# EAGLE design controller7b (EAGLE 8.1.1)

## Sheet 1 of 2
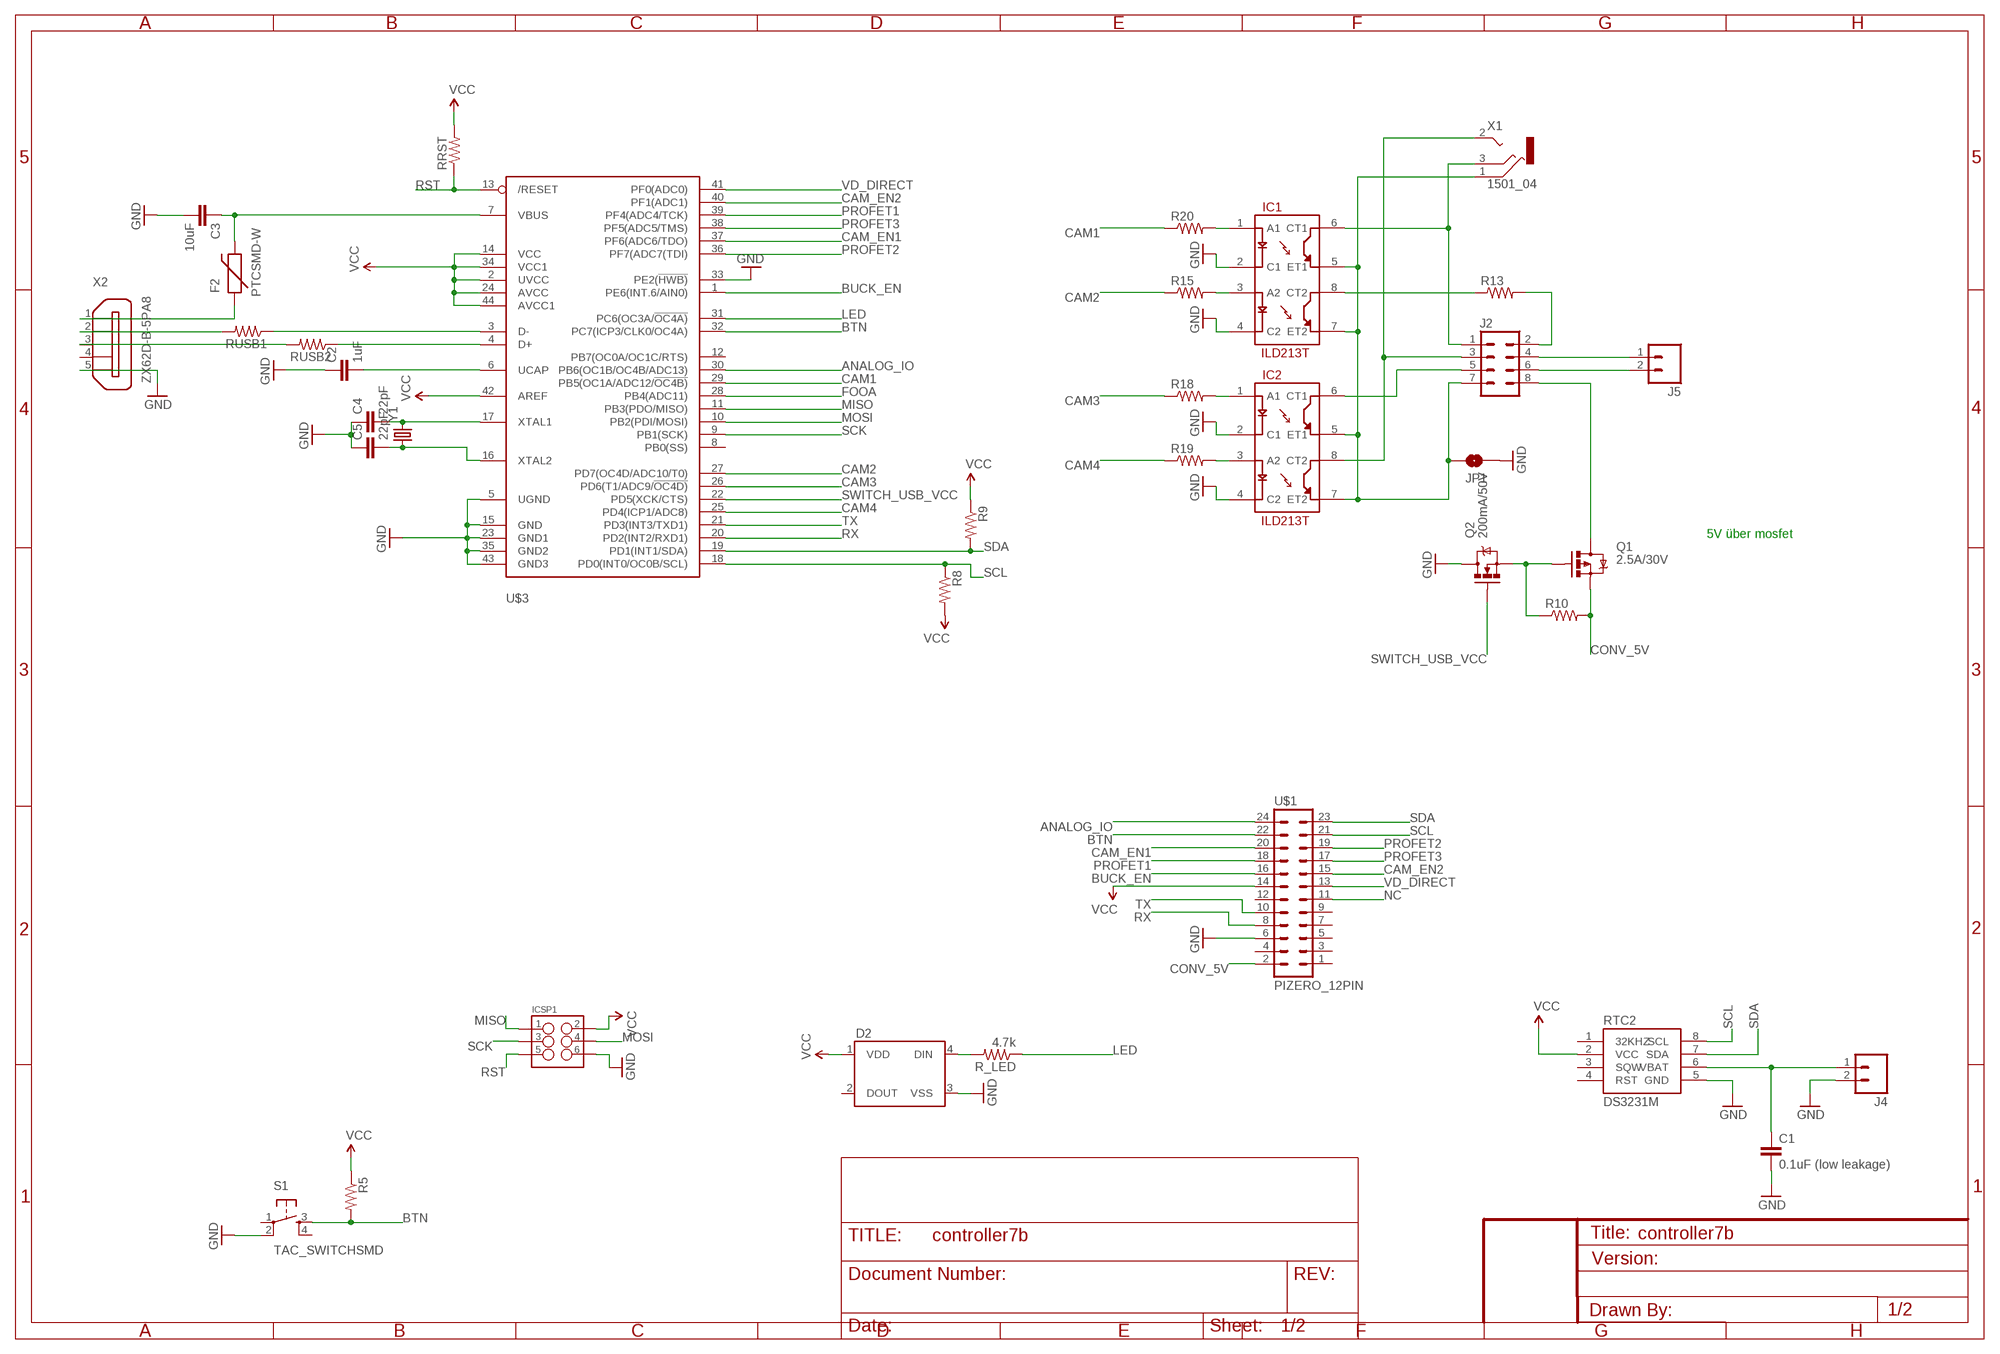
[diagram p0: schematic, sheet 1]

### Parts
C1  0.1uF (low leakage)  CAP1206  [1206]
C2  1uF  CAP1206  [1206]
C3  10uF  CAP1206  [1206]
C4  22pF  CAP0805  [0805]
C5  22pF  CAP0805  [0805]
D2  WS2812B  [WS2812B]
F2  PTCSMD-W  [PTC-1206-WIDE]
IC1  ILD213T  [SO08]
IC2  ILD213T  [SO08]
ICSP1  M03X2FEMALE  [2X3]
J2  M04X2  [2X4]
J4  M02PTH  [1X02]
J5  M02PTH  [1X02]
JP1  JUMPER-PAD-2-NOYES_SILK  [PAD-JUMPER-2-NO_YES_SILK]
Q1  2.5A/30V  MOSFET-PCHANNELDMG2307L  [SOT23-3]
Q2  200mA/50V  MOSFET-NCHANNELBSS138  [SOT23-3]
R5  RESISTOR1206  [1206]
R8  RESISTOR1206  [1206]
R9  RESISTOR1206  [1206]
R10  RESISTOR0805-RES  [0805]
R13  RESISTOR1206  [1206]
R15  RESISTOR0805-RES  [0805]
R18  RESISTOR0805-RES  [0805]
R19  RESISTOR0805-RES  [0805]
R20  RESISTOR0805-RES  [0805]
R_LED  4.7k  RESISTOR1206  [1206]
RRST  RESISTOR1206  [1206]
RTC2  DS3231M  [SOIC8]
RUSB1  RESISTOR1206  [1206]
RUSB2  RESISTOR1206  [1206]
S1  TAC_SWITCHSMD  TAC_SWITCHPTH  [TACTILE-PTH]
U$1  PIZERO_12PIN  [PIZERO_12PIN]
U$3  ATMEGA32U4-AU  [TQFP44]
X1  1501_04  [1501_05]
X2  ZX62D-B-5PA8  [ZX62D-B-5PA8]
Y1  CRYSTALCRYSTAL-SMD-5X3-16MHZ  [CRYSTAL-SMD-5X3]

### Nets
ANALOG_IO: U$1.24 U$3.30(PB6(OC1B/OC4B/ADC13))
BTN: R5.2 S1.3 U$1.22 U$3.32(PC7(ICP3/CLK0/OC4A))
BUCK_EN: U$1.16 U$3.1(PE6(INT.6/AIN0))
CAM1: R20.1 U$3.29(PB5(OC1A/ADC12/!OC4B))
CAM2: R15.1 U$3.27(PD7(OC4D/ADC10/T0))
CAM3: R18.1 U$3.26(PD6(T1/ADC9/!OC4D))
CAM4: R19.1 U$3.25(PD4(ICP1/ADC8))
CAM_EN1: U$1.20 U$3.37(PF6(ADC6/TDO))
CAM_EN2: U$1.15 U$3.40(PF1(ADC1))
CONV_5V [power]: Q1.2(S) R10.2 U$1.2
FOOA: U$3.28(PB4(ADC11))
GND [power]: C1.2 C2.1 C3.2 C4.1 C5.1 D2.3(VSS) IC1.2(C1) IC1.4(C2) IC2.2(C1) IC2.4(C2) ICSP1.6 J4.2 JP1.1 Q2.3(D) RTC2.5(GND) S1.2 U$1.6 U$3.5(UGND) U$3.15(GND) U$3.23(GND1) U$3.33(PE2(!HWB)) U$3.35(GND2) U$3.43(GND3) X2.5
LED: R_LED.1 U$3.31(PC6(OC3A/!OC4A))
MISO: ICSP1.1 U$3.11(PB3(PDO/MISO))
MOSI: ICSP1.4 U$3.10(PB2(PDI/MOSI))
N$1: J2.4 J5.1
N$4: RUSB1.1 U$3.3(D-)
N$5: RUSB2.1 U$3.4(D+)
N$6: J2.6 J5.2
N$7: D2.4(DIN) R_LED.2
N$8: C4.2 U$3.17(XTAL1) Y1.3
N$9: C5.2 U$3.16(XTAL2) Y1.1
N$10: RUSB1.2 X2.2
N$11: RUSB2.2 X2.3
N$12: IC2.1(A1) R18.2
N$13: IC2.3(A2) R19.2
N$15: IC1.3(A2) R15.2
N$16: J2.2 R13.2
N$18: IC1.8(CT2) R13.1
N$19: IC1.1(A1) R20.2
N$20: C2.2 U$3.6(UCAP)
N$22: C3.1 F2.2 U$3.7(VBUS)
N$31: IC1.6(CT1) J2.1 X1.3
N$32: IC2.8(CT2) J2.3 X1.2
N$33: IC2.6(CT1) J2.5
N$34: IC1.5(ET1) IC1.7(ET2) IC2.5(ET1) IC2.7(ET2) J2.7 JP1.2 X1.1
N$35: J2.8 Q1.3(D)
N$36: Q1.1(G) Q2.2(S) R10.1
N$38: F2.1 X2.1
N$39: C1.1 J4.1 RTC2.6(VBAT)
NC: U$1.11
PROFET1: U$1.18 U$3.39(PF4(ADC4/TCK))
PROFET2: U$1.19 U$3.36(PF7(ADC7(TDI))
PROFET3: U$1.17 U$3.38(PF5(ADC5/TMS))
RST: ICSP1.5 RRST.1 U$3.13(/RESET)
RX: U$1.8 U$3.20(PD2(INT2/RXD1))
SCK: ICSP1.3 U$3.9(PB1(SCK))
SCL: R8.1 RTC2.8(SCL) U$1.21 U$3.18(PD0(INT0/OC0B/SCL))
SDA: R9.2 RTC2.7(SDA) U$1.23 U$3.19(PD1(INT1/SDA))
SWITCH_USB_VCC: Q2.1(G) U$3.22(PD5(XCK/CTS))
TX: U$1.10 U$3.21(PD3(INT3/TXD1))
VCC [power]: D2.1(VDD) ICSP1.2 R5.1 R8.2 R9.1 RRST.2 RTC2.2(VCC) U$1.14 U$3.2(UVCC) U$3.14(VCC) U$3.24(AVCC) U$3.34(VCC1) U$3.42(AREF) U$3.44(AVCC1)
VD_DIRECT: U$1.13 U$3.41(PF0(ADC0))
Unconnected: D2.2(DOUT) RTC2.1(32KHZ) RTC2.3(SQW) RTC2.4(RST) S1.1 S1.4 U$1.1 U$1.3 U$1.4 U$1.5 U$1.7 U$1.9 U$1.12 U$3.8(PB0(SS)) U$3.12(PB7(OC0A/OC1C/RTS)) X2.4 X2.S1 X2.S2 X2.S3 X2.S4

### Notes on the sheet
- 5V über mosfet

## Sheet 2 of 2
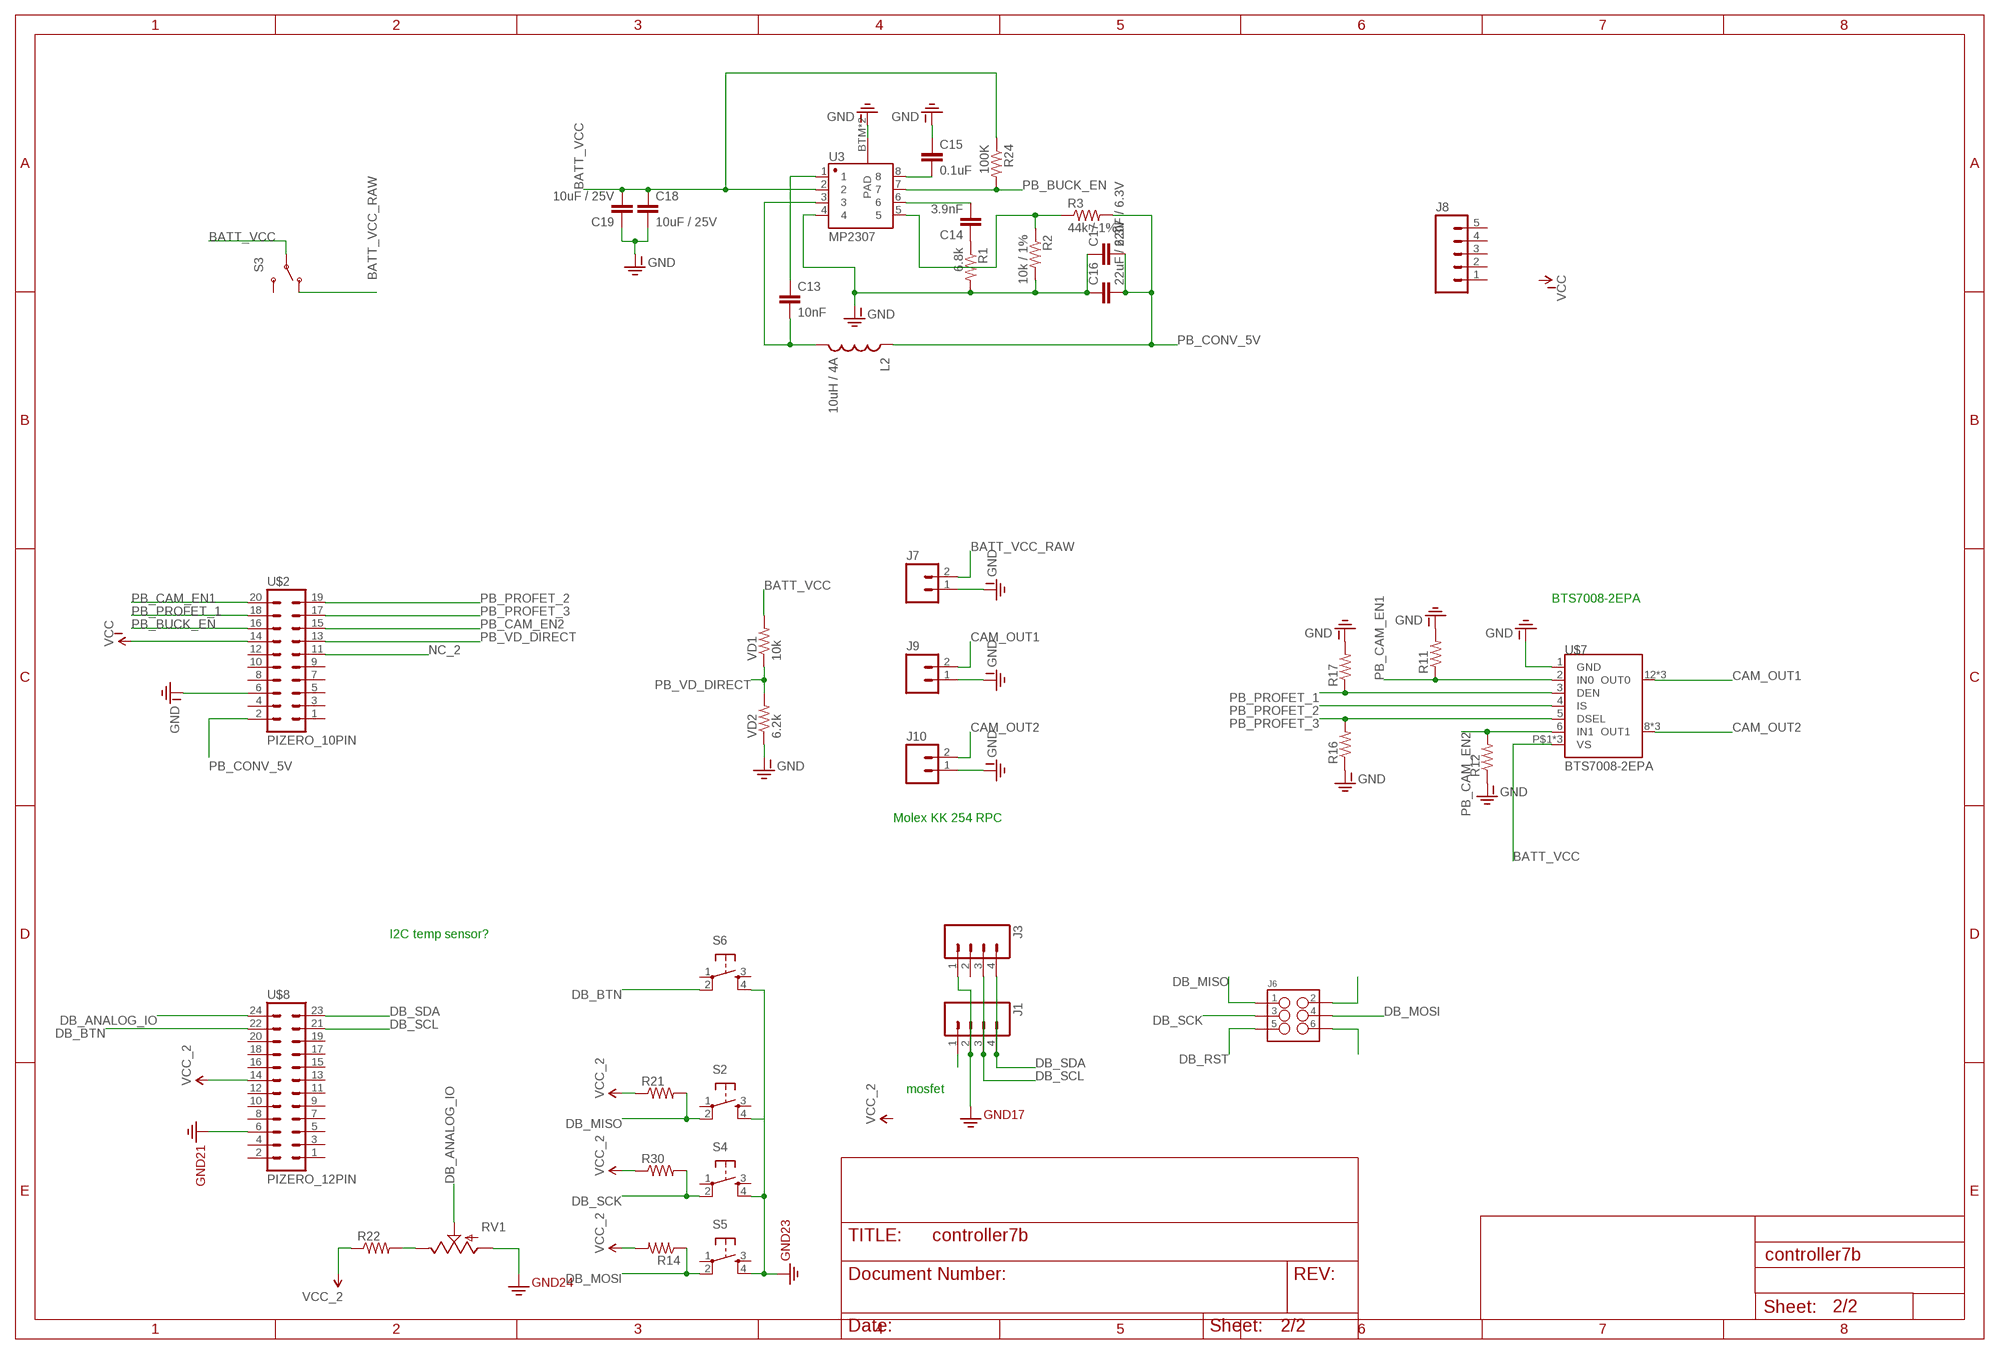
[diagram p1: schematic, sheet 2]

### Parts
C13  10nF  CAP1206  [1206]
C14  3.9nF  CAP0805  [0805]
C15  0.1uF  CAP0805  [0805]
C16  22uF / 6.3V  CAP1210  [1210]
C17  22uF / 6.3V  CAP1210  [1210]
C18  10uF / 25V  CAP1210  [1210]
C19  10uF / 25V  CAP1210  [1210]
J1  M04LOCK  [1X04_LOCK]
J3  M04LOCK  [1X04_LOCK]
J6  M03X2FEMALE  [2X3]
J7  M02LOCK  [1X02_LOCK]
J8  M05LOCK  [1X05_LOCK]
J9  M02LOCK  [1X02_LOCK]
J10  M02LOCK  [1X02_LOCK]
L2  10uH / 4A  INDUCTORSRU1038  [SRU1038]
R1  6.8k  RESISTOR0805-RES  [0805]
R2  10k / 1%  RESISTOR0805-RES  [0805]
R3  44k / 1%  RESISTOR0805-RES  [0805]
R11  RESISTOR1206  [1206]
R12  RESISTOR1206  [1206]
R14  RESISTOR1206  [1206]
R16  RESISTOR1206  [1206]
R17  RESISTOR1206  [1206]
R21  RESISTOR1206  [1206]
R22  RESISTOR1206  [1206]
R24  100K  RESISTOR0805-RES  [0805]
R30  RESISTOR1206  [1206]
RV1  POT  [ALPS_POT]
S2  TAC_SWITCHPTH  [TACTILE-PTH]
S3  SWITCH-SPDTPTH_LOCK  [SWITCH-SPDT_LOCK.007S]
S4  TAC_SWITCHPTH  [TACTILE-PTH]
S5  TAC_SWITCHPTH  [TACTILE-PTH]
S6  TAC_SWITCHPTH  [TACTILE-PTH]
U3  MP2307  GENERIC-SOIC8MSGEQ7N-FILTER  [SO08]
U$2  PIZERO_10PIN  [PIZERO_10PIN]
U$7  BTS7008-2EPA  [SOIC-14-PAD]
U$8  PIZERO_12PIN  [PIZERO_12PIN]
VD1  10k  RESISTOR1206  [1206]
VD2  6.2k  RESISTOR1206  [1206]

### Nets
3.3V [power]: J1.2 J3.1 RV1.P$3(A) S2.4 S4.4 S5.4 S6.4 U$8.6 ; supply symbol labelled GND2
BATT_VCC [camera_power]: C18.1 C19.2 R24.1 S3.2(P) U3.2 U$7.P$1(VS) U$7.P$2(VS) U$7.VS VD1.2
BATT_VCC_RAW [camera_power]: J7.2 S3.1(O)
CAM_OUT1 [camera_power]: J9.2 U$7.12(OUT0) U$7.13(OUT0) U$7.14(OUT0)
CAM_OUT2 [camera_power]: J10.2 U$7.8(OUT1) U$7.9(OUT1) U$7.10(OUT1)
DB_ANALOG_IO: RV1.P$2(S) U$8.24
DB_BTN: S6.2 U$8.22
DB_MISO: J6.1 R21.2 S2.2
DB_MOSI: J6.4 R14.1 S5.2
DB_RST: J6.5
DB_SCK: J6.3 R30.2 S4.2
DB_SCL: J1.3 J3.3 U$8.21
DB_SDA: J1.4 J3.4 U$8.23
GND-ISO [power]: C15.1 C16.1 C17.1 C18.2 C19.1 J7.1 J9.1 J10.1 R1.2 R2.2 R11.2 R12.1 R16.1 R17.2 U3.4 U3.BTM(PAD) U3.P$1(PAD) U$2.6 U$7.1(GND) VD2.1 ; supply symbol labelled GND
N$25: C15.2 U3.8
N$26 [power]: C13.2 L2.2 U3.3
N$27: C13.1 U3.1
N$28: C14.1 R1.1
N$29: C14.2 U3.6
N$30: R2.1 R3.1 U3.5
N$37 [camera_power]: J1.1
N$43: R22.2 RV1.P$1(E)
N$45: J6.2
N$46: J6.6
NC_2: U$2.11
PB_BUCK_EN: R24.2 U3.7 U$2.16
PB_CAM_EN1: R11.1 U$2.20 U$7.2(IN0)
PB_CAM_EN2: R12.2 U$2.15 U$7.6(IN1)
PB_CONV_5V [power]: C16.2 C17.2 L2.1 R3.2 U$2.2
PB_PROFET_1: R17.1 U$2.18 U$7.3(DEN)
PB_PROFET_2: U$2.19 U$7.4(IS)
PB_PROFET_3: R16.2 U$2.17 U$7.5(DSEL)
PB_VD_DIRECT: U$2.13 VD1.1 VD2.2
VCC-ISO [power]: U$2.14 ; supply symbol labelled VCC
VCC_2 [power]: R14.2 R21.1 R22.1 R30.1 U$8.14
Unconnected: J3.2 J8.1 J8.2 J8.3 J8.4 J8.5 S2.1 S2.3 S3.3(S) S4.1 S4.3 S5.1 S5.3 S6.1 S6.3 U$2.1 U$2.3 U$2.4 U$2.5 U$2.7 U$2.8 U$2.9 U$2.10 U$2.12 U$8.1 U$8.2 U$8.3 U$8.4 U$8.5 U$8.7 U$8.8 U$8.9 U$8.10 U$8.11 U$8.12 U$8.13 U$8.15 U$8.16 U$8.17 U$8.18 U$8.19 U$8.20

### Notes on the sheet
- BTS7008-2EPA
- Molex KK 254 RPC
- I2C temp sensor?
- mosfet

## Library data of the parts
C1 C2 C13-C19 = SparkFun-Capacitors:CAP: Capacitor Standard 0603 ceramic capacitor, and 0.1" leaded capacitor.
C3-C5 = SparkFun-Passives:CAP: Capacitor Standard 0603 ceramic capacitor, and 0.1" leaded capacitor.
D2 = SparkFun-LED:WS2812B: WS2812B - Intelligent control LED integrated light source Technical Specifications: Power Supply Voltage (VDD): 3.5 to 5.3 V Input Voltage (VI): -0.5 to VDD+0.5 V Operating Junction Temperature (Topt): -25°C to +80°C Storage Temperature Range (Tstg): -55°C to +150°C; PROD_ID: DIO-12503
F2 = SparkFun-PowerIC:PTC: Resettable Fuse PTC Resettable Fuse. Spark Fun Electronics SKU : COM-08357
IC1 IC2 = SparkFun-DiscreteSemi:ILD213T: Dual optoisolator.
ICSP1 J6 = SparkFun-Connectors:M03X2: 2x3 .1" header. Shrouded, with keying- CONN-10681 SMT- CONN-11415 Pogo pins- HW-11044; PROD_ID: CONN-11566; VALUE: FEMALE 2x3
J1 J3 = SparkFun-Connectors:M04: Header 4 Standard 4-pin 0.1" header. Use with straight break away headers (SKU : PRT-00116), right angle break away headers (PRT-00553), swiss pins (PRT-00743), machine pins (PRT-00117), and female headers (PRT-00115). Molex polarized connector foot print use with SKU : PRT-08231 with associated crimp pins and housings. 1MM SMD Version SKU: PRT-10208; PROD_ID: CONN-09696
J2 = SparkFun-Connectors:M04X2: .1" header, two rows of four.
J4 J5 J7 J9 J10 = SparkFun-Connectors:M02: Standard 2-pin 0.1" header. Use with - straight break away headers ( PRT-00116) - right angle break away headers (PRT-00553) - swiss pins (PRT-00743) - machine pins (PRT-00117) - female headers (PRT-00115) Molex polarized connector foot print use with: PRT-08233 with associated crimp pins and housings. 2.54_SCREWTERM for use with PRT-10571. 3.5mm Screw Terminal footprints for PRT-08084 5mm Screw Terminal footprints for use with PRT-08432
J8 = SparkFun-Connectors:M05: Header 5 Standard 5-pin 0.1" header. Use with straight break away headers (SKU : PRT-00116), right angle break away headers (PRT-00553), swiss pins (PRT-00743), machine pins (PRT-00117), and female headers (PRT-00115). Molex polarized connector foot print use with SKU : PRT-08230 with associated crimp pins and housings.
JP1 = SparkFun-Passives:JUMPER-PAD-2-NO
L2 = SparkFun-Passives:INDUCTOR: Inductors Basic Inductor/Choke - 0603 and 1206. Footprints are not proven and vary greatly between part numbers. INDUCTOR POWER 3.3UH 4.0A SMD 0.197" L x 0.197" W x 0.177" H (5.00mm x 5.00mm x 4.50mm)
Q1 = SparkFun-DiscreteSemi:MOSFET-PCHANNEL: Generic PMOSFET IRLML2244 - TRANS-11153 (SOT-23 -20V -4.3A) (1.Gate 2.Source 3.Drain) FQP27P06 - COM-10349 <http://www.sparkfun.com/products/10349> (TO-220 -60V -27A) (1.Gate 2.Source 3.Drain); PROD_ID: TRANS-11308
Q2 = SparkFun-DiscreteSemi:MOSFET-NCHANNEL: Common NMOSFET Parts MFG P/N Store ID Prod ID FDD8780 TRANS-09984 SI7820DN TRANS-11055 FDS6630A IC-08089 2N7002PW TRANS-11151 FQP30N06L COM-10213 TRANS-10060 BSS123LT1G TRANS-08345 BSS138 TRANS-00830 BS170 2N7000; PROD_ID: TRANS-00830
R1-R3 R24 R_LED = SparkFun-Resistors:RESISTOR: Resistor Basic schematic elements and footprints for 0603, 1206, and PTH resistors.
R5 R8-R22 R30 RRST RUSB1 RUSB2 VD1 VD2 = SparkFun-Passives:RESISTOR: Resistor Basic schematic elements and footprints for 0603, 1206, and PTH resistors.
RTC2 = SparkFun-DigitalIC:DS3231M: DS3231M Real Time Clock. Accuracy +/-5ppm. Battery Backup. 2.3V to 5.5V.; PROD_ID: IC-11985
RV1 = SparkFun-Electromechanical:POT; PROD_ID: RES-09177
S1 S2 S4-S6 = SparkFun-Retired:TAC_SWITCH: Momentary Switch Button commonly used for reset or general input. Spark Fun Electronics SKU : COM-00097 SMT- SWCH-08247
S3 = SparkFun-Electromechanical:SWITCH-SPDT: SPDT Switch Simple slide switch, Spark Fun Electronics SKU : COM-00102 DPDT SMT slide switch, AYZ0202, SWCH-08179
U3 = SparkFun-AnalogIC:GENERIC-SOIC8: A placeholder for generic narrow & wide SOIC8 foorptints - used on the DIP adapter board.; PROD_ID: IC-10141
U$1 U$8 = pizero:PIZERO_12PIN
U$2 = pizero:PIZERO_10PIN
U$3 = adafruit:ATMEGA32U4: http://www.ladyada.net/library/eagle
U$7 = SparkFun-DigitalIC:BTS7008-2EPA
X1 = con-lumberg:1501_0*: Jack connectors according to JISC 6560, 2.5 mm Klinkensteckverbinder nach JISC 6560, 2,5 mm Source: http://www.lumberg.com/Produkte/PDFs/1501_05.pdfedit 1501_03 http://www.lumberg.com/Produkte/PDFs/1501_06.pdf; OC_FARNELL: 1216977; OC_NEWARK: unknown
X2 = zx62d-b-5pa8-oshpark_10:ZX62D-B-5PA8: Micro USB Type B Connector - Standard, Shell Through Hole Source: http://www.hirose.co.jp/cataloge_hp/ed_ZX_20140804.pdf; MF: Hirose; MPN: ZX62D-B-5PA8; OC_FARNELL: 2300438; OC_NEWARK: 69W0712
Y1 = SparkFun-FreqCtrl:CRYSTAL: Various standard crystals. Proven footprints.; PROD_ID: XTAL-08218

## Net classes
0 default: width 0.254 mm, clearance 0.254 mm
1 power: width 0.356 mm, clearance 0.254 mm
2 camera_power: width 0.66 mm, clearance 0.254 mm
3 usbsignal: width 0.254 mm, clearance 0.203 mm

## Board
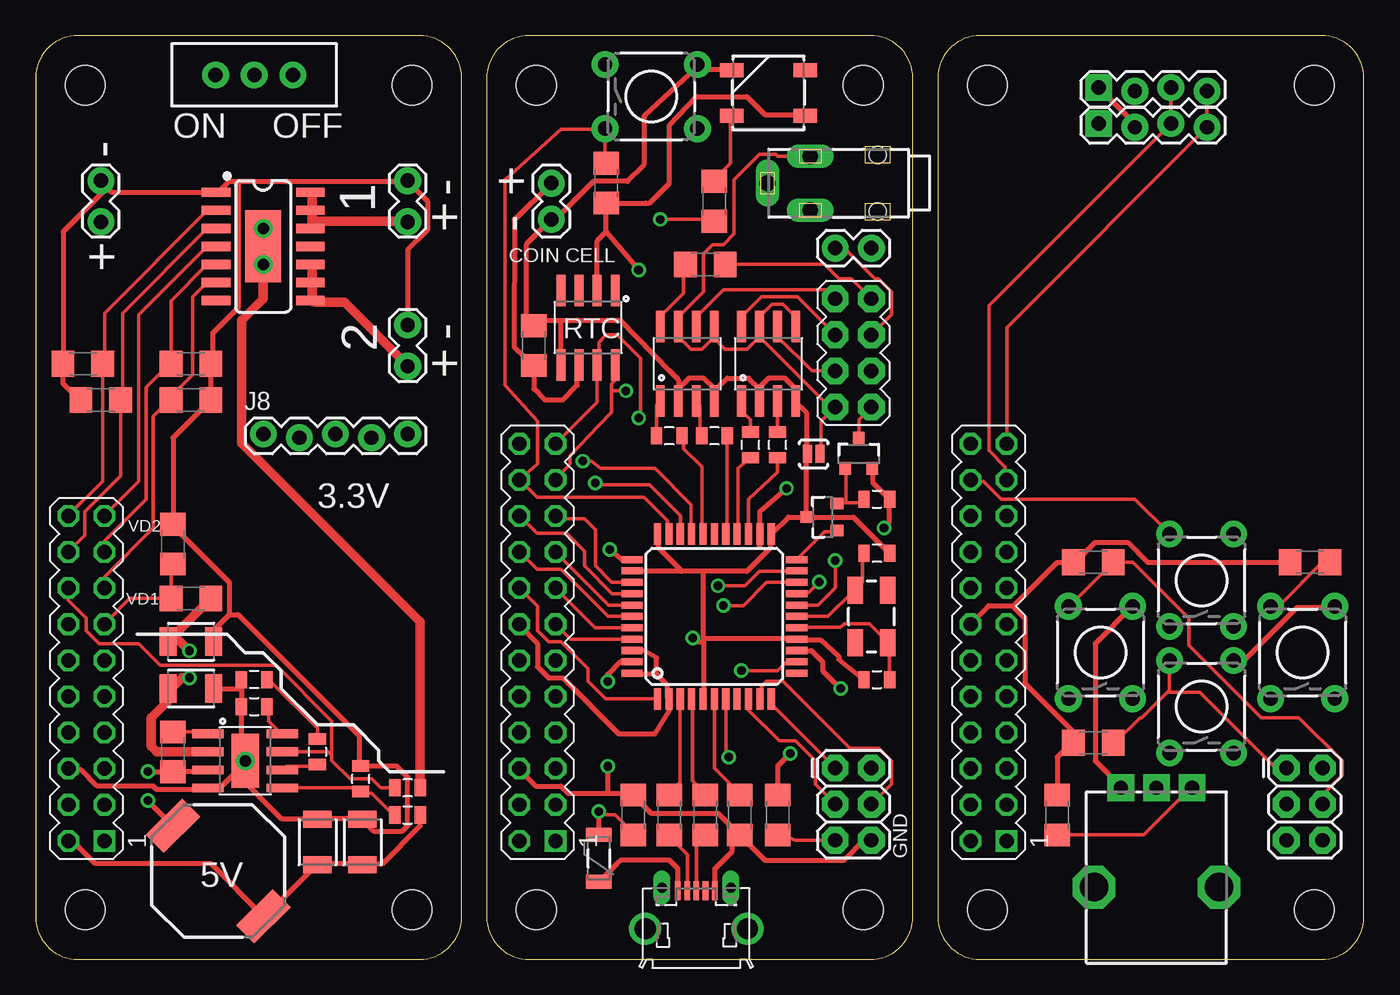
[diagram p2: board, top side]
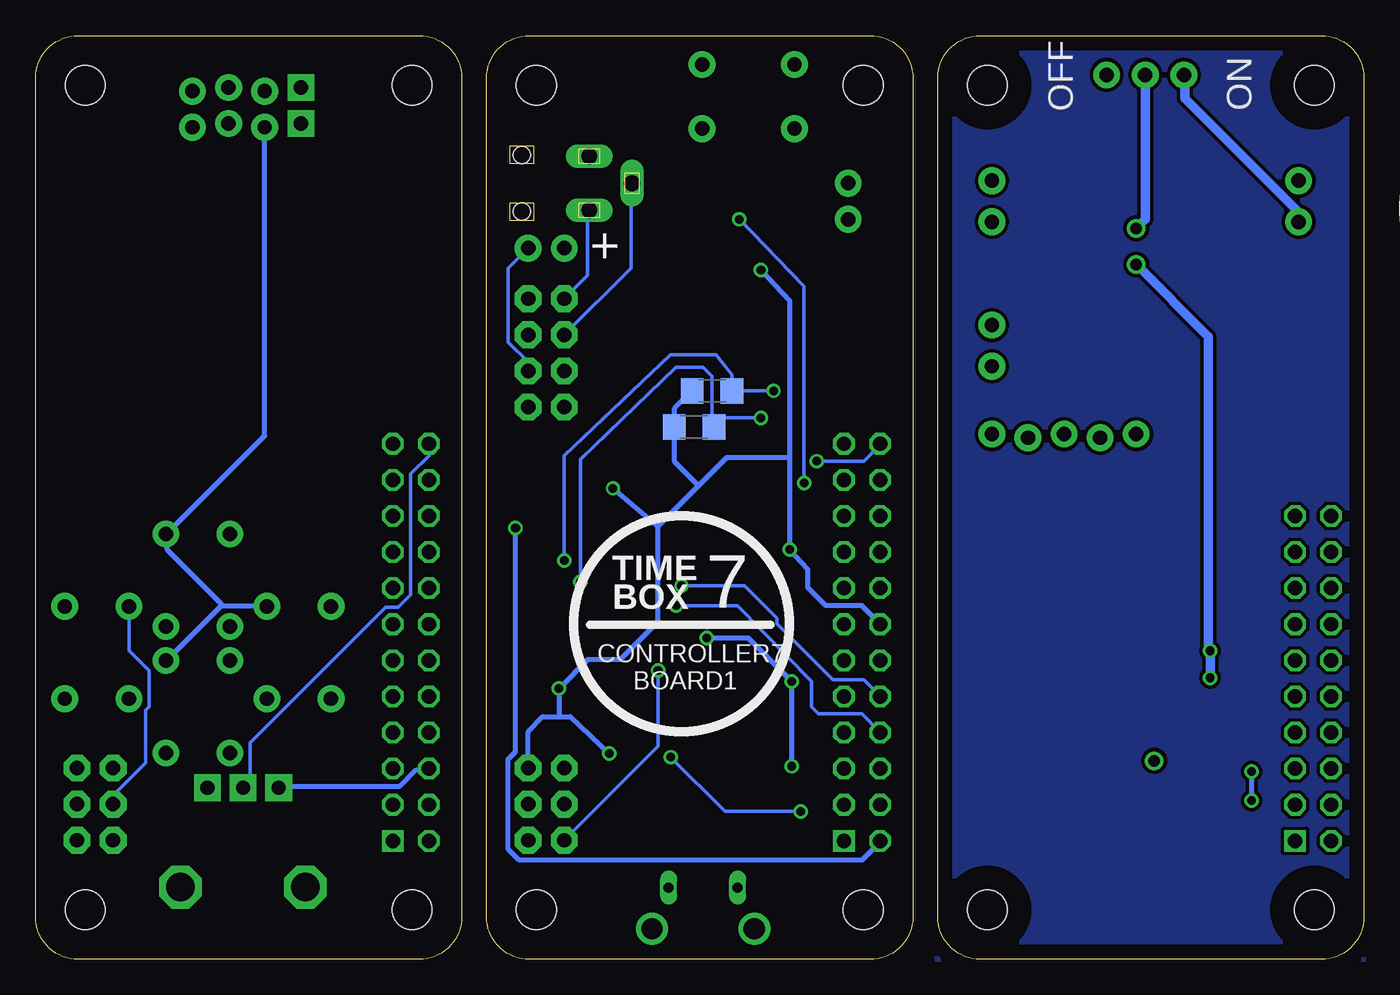
[diagram p3: board, bottom side, seen from below]

Size 93.5 x 65 mm. Coordinates in mm from the lower left corner, seen from the top.
Copper layers (1*16): Top 0.035mm / dielectric 1.5mm / Bottom 0.035mm
Design rules "default": minimum track width 10mil, minimum drill 24mil, track to track 8mil, track to pad 8mil, pad to pad 8mil, via to via 8mil, smd to smd 8mil, copper to edge 40mil, drill to drill 8mil, minimum pad ring 10mil, minimum via ring 8mil, stop-mask expansion 4mil, vias tented up to drill 0mil, thermal gap 10mil

### Footprints (pad centres in the part's own frame; a part is rotated, then mirrored left to right if it is on the bottom)
1206 = smd 1.6 x 1.8: 1 -1.4,0; 2 1.4,0
0805 = smd 0.8 x 1.2: 1 -0.9,0; 2 0.9,0
1210 = smd 1.2 x 2: 1 -1.6,0; 2 1.6,0
WS2812B = smd 1.651 x 1: 1 -2.577,1.6; 2 -2.577,-1.6; 3 2.577,-1.6; 4 2.577,1.6
PTC-1206-WIDE = smd 1 x 1.8: 1 -1.654,0; 2 1.654,0
SO08 = smd 0.61 x 2.21: 1 -1.905,-2.616; 2 -0.635,-2.616; 3 0.635,-2.616; 4 1.905,-2.616; 5 1.905,2.616; 6 0.635,2.616; 7 -0.635,2.616; 8 -1.905,2.616
2X3 = drill 1.016 pad 1.88 octagon: 1 0,0; 2 0,2.54; 3 2.54,0; 4 2.54,2.54; 5 5.08,0; 6 5.08,2.54
1X04_LOCK = drill 1.016 pad 1.88 square: 1 0,0.127 | drill 1.016 pad 1.88: 2 2.54,-0.127; 3 5.08,0.127; 4 7.62,-0.127
2X4 = drill 1.016 pad 1.88 octagon: 1 -3.81,-1.27; 2 -3.81,1.27; 3 -1.27,-1.27; 4 -1.27,1.27; 5 1.27,-1.27; 6 1.27,1.27; 7 3.81,-1.27; 8 3.81,1.27
1X02 = drill 1.016 pad 1.88: 1 0,0; 2 2.54,0
1X02_LOCK = drill 1.016 pad 1.88: 1 -0.178,0; 2 2.718,0
1X05_LOCK = drill 1.016 pad 1.88: 1 0,0.127; 2 2.54,-0.127; 3 5.08,0.127; 4 7.62,-0.127; 5 10.16,0.127
PAD-JUMPER-2-NO_YES_SILK = smd 0.635 x 1.27: 1 -0.45,0; 2 0.45,0
SRU1038 = smd 1.8 x 3.6: 1 -4.5,0; 2 4.5,0
SOT23-3 = smd 0.8 x 0.9: 1 -0.95,-1; 2 0.95,-1; 3 0,1.1
SOIC8 = smd 0.61 x 2.21: 1 -1.905,-2.616; 2 -0.635,-2.616; 3 0.635,-2.616; 4 1.905,-2.616; 5 1.905,2.616; 6 0.635,2.616; 7 -0.635,2.616; 8 -1.905,2.616
ALPS_POT = drill 1 pad 1.88 square: P$1 7,-2.5; P$2 7,0; P$3 7,2.5 | drill 2 octagon: P$4 0,-4.4; P$5 0,4.4
TACTILE-PTH = drill 1.016 pad 1.88: 1 -3.251,2.261; 2 3.251,2.261; 3 -3.251,-2.261; 4 3.251,-2.261
SWITCH-SPDT_LOCK.007S = drill 1.016 pad 1.88: 1 0,2.718; 2 0,0; 3 0,-2.718
SO08' = smd 0.61 x 2.21: 1 -1.905,-2.616; 2 -0.635,-2.616; 3 0.635,-2.616; 4 1.905,-2.616; 5 1.905,2.616; 6 0.635,2.616; 7 -0.635,2.616; 8 -1.905,2.616 | smd 3.81 x 1.93: BTM 0,0 | drill 0.8: P$1 0,0
PIZERO_12PIN = drill 1.016 square: 1 8.34,25.15 | drill 1.016 octagon: 2 8.34,27.69; 3 10.88,25.15; 4 10.88,27.69; 5 13.42,25.15; 6 13.42,27.69; 7 15.96,25.15; 8 15.96,27.69; 9 18.5,25.15; 10 18.5,27.69; 11 21.04,25.15; 12 21.04,27.69; 13 23.58,25.15; 14 23.58,27.69; 15 26.12,25.15; 16 26.12,27.69; 17 28.66,25.15; 18 28.66,27.69; 19 31.2,25.15; 20 31.2,27.69; 21 33.74,25.15; 22 33.74,27.69; 23 36.28,25.15; 24 36.28,27.69 | hole 2.8: 3.5,3.5; 3.5,26.5; 61.5,26.5; 61.5,3.5
PIZERO_10PIN = drill 1.016 square: 1 8.34,25.15 | drill 1.016 octagon: 2 8.34,27.69; 3 10.88,25.15; 4 10.88,27.69; 5 13.42,25.15; 6 13.42,27.69; 7 15.96,25.15; 8 15.96,27.69; 9 18.5,25.15; 10 18.5,27.69; 11 21.04,25.15; 12 21.04,27.69; 13 23.58,25.15; 14 23.58,27.69; 15 26.12,25.15; 16 26.12,27.69; 17 28.66,25.15; 18 28.66,27.69; 19 31.2,25.15; 20 31.2,27.69 | hole 2.8: 3.5,3.5; 3.5,26.5; 61.5,26.5; 61.5,3.5
TQFP44 = smd 1.5 x 0.5: 1 -5.8,4; 2 -5.8,3.2; 3 -5.8,2.4; 4 -5.8,1.6; 5 -5.8,0.8; 6 -5.8,0; 7 -5.8,-0.8; 8 -5.8,-1.6; 9 -5.8,-2.4; 10 -5.8,-3.2; 11 -5.8,-4; 23 5.8,-4; 24 5.8,-3.2; 25 5.8,-2.4; 26 5.8,-1.6; 27 5.8,-0.8; 28 5.8,0; 29 5.8,0.8; 30 5.8,1.6; 31 5.8,2.4; 32 5.8,3.2; 33 5.8,4 | smd 0.5 x 1.5: 12 -4,-5.8; 13 -3.2,-5.8; 14 -2.4,-5.8; 15 -1.6,-5.8; 16 -0.8,-5.8; 17 0,-5.8; 18 0.8,-5.8; 19 1.6,-5.8; 20 2.4,-5.8; 21 3.2,-5.8; 22 4,-5.8; 34 4,5.8; 35 3.2,5.8; 36 2.4,5.8; 37 1.6,5.8; 38 0.8,5.8; 39 0,5.8; 40 -0.8,5.8; 41 -1.6,5.8; 42 -2.4,5.8; 43 -3.2,5.8; 44 -4,5.8
SOIC-14-PAD = smd 0.66 x 2.032: 1 -4.445,-3.315; 2 -3.175,-3.315; 3 -1.905,-3.315; 4 -0.635,-3.315; 5 0.635,-3.315; 6 1.905,-3.315; 7 3.175,-3.315; 8 3.175,3.315; 9 1.905,3.315; 10 0.635,3.315; 11 -0.635,3.315; 12 -1.905,3.315; 13 -3.175,3.315; 14 -4.445,3.315 | drill 0.8: P$1 -1.905,0; P$2 0.635,0 | smd 5.08 x 2.54: VS -0.635,0
1501_05 = drill 1.1 pad 1.4 long: 1 -1.9,-8.5; 2 0,-11.5; 3 1.9,-8.5 | hole 1.2: -2,-3.75; 2,-3.75
ZX62D-B-5PA8 = smd 1.35 x 0.4: 1 4.825,1.3; 2 4.825,0.65; 3 4.825,0; 4 4.825,-0.65; 5 4.825,-1.3 | drill 1.5: S1 2.15,-3.6; S2 2.15,3.6 | drill 0.7 long: S3 5.05,2.425; S4 5.05,-2.425
CRYSTAL-SMD-5X3 = smd 1.9 x 1.1: 1 -1.85,-1.15; 2 1.85,-1.15; 3 1.85,1.15; 4 -1.85,1.15

### Placement (x,y rotation side)
C1  35.08,43.18 90 top
C2  49.56,10.16 90 top
C3  42.06,10.16 90 top
C4  59.21,28.57 180 top
C5  59.21,19.68 0 top
C13  9.68,14.61 270 top
C14  19.84,14.61 270 top
C15  15.39,17.78 0 top
C16  23.02,8.26 270 top
C17  19.84,8.26 270 top
C18  10.95,22.35 0 top
C19  10.95,19.05 180 top
D2  51.59,60.96 180 top
F2  39.65,7.11 90 top
IC1  45.88,41.91 0 top
IC2  51.59,41.91 0 top
ICSP1  56.29,13.46 270 top
J1  74.83,58.67 0 top
J2  57.56,42.67 270 top
J3  74.83,61.21 0 top
J4  36.3,54.61 270 top
J5  56.29,50.04 0 top
J6  88.04,13.46 270 top
J7  4.6,54.61 270 top
J8  16.03,36.83 0 top
J9  26.19,54.61 270 top
J10  26.19,44.45 270 top
JP1  54.77,35.56 0 top
L2  12.86,6.22 135 top
Q1  57.94,35.56 0 top
Q2  55.4,31.11 90 top
R1  15.39,19.68 180 top
R2  22.89,12.7 90 top
R3  26.19,10.16 0 top
R5  40.16,54.61 90 top
R8  45.88,40.01 180 bottom
R9  47.14,37.47 0 bottom
R10  59.21,32.38 0 top
R11  3.33,41.91 180 top
R12  10.95,39.37 180 top
R13  47.14,48.9 0 top
R14  74.45,27.94 180 top
R15  47.78,36.83 180 top
R16  10.95,41.91 180 top
R17  4.6,39.37 180 top
R18  50.32,36.2 90 top
R19  52.22,36.2 90 top
R20  44.61,36.83 180 top
R21  74.45,15.24 0 top
R22  71.91,10.16 270 top
R24  26.19,12.06 180 top
R30  89.69,27.94 0 top
R_LED  47.78,53.34 90 top
RRST  52.22,10.16 90 top
RTC2  38.89,44.45 180 top
RUSB1  44.61,10.16 270 top
RUSB2  47.14,10.16 270 top
RV1  78.89,5.08 90 top
S1  43.33,60.71 0 top
S2  82.07,17.78 90 top
S3  15.39,62.23 90 top
S4  89.18,21.59 90 top
S5  74.96,21.59 90 top
S6  82.07,26.67 90 top
U3  MP2307  [SO08']  14.76,13.97 270 top
U$1  61.75,0 90 top
U$2  30,0 90 top
U$3  47.78,24.13 90 top
U$7  16.03,49.53 270 top
U$8  93.5,0 90 top
VD1  10.95,25.4 0 top
VD2  9.68,29.21 270 top
X1  63.02,54.61 270 top
X2  46.51,0 90 top
Y1  58.83,24.13 90 top

### Tracks (layer width: path | path; a pad name or v marks a point on that pad's centre or on a via)
3.3V
  Top 0.356: J1.2 77.37,58.8 J3.1 | S4.4 91.34,24.77 88.8,24.77 85.12,21.08 84.36,21.08 S2.4 | RV1.P$3 76.35,12.19 74.58,13.97 74.58,22.23 77.12,24.77 S5.4
  Bottom 0.356: U$8.6 65.81,13.34 66.7,13.34 67.85,12.19 76.35,12.19 RV1.P$3 | 80.42,24.89 77.24,24.89 S5.4 | 80.42,24.89 84.23,21.08 S2.4 | 80.42,24.89 80.42,25.02 84.23,28.83 84.23,29.84 S6.4 84.23,29.97 77.37,36.83 J1.2
ANALOG_IO  (via drill 0.6)
  Top 0.254: U$3.30 46.13,29.97 46.13,32 43.59,34.54 39.78,34.54 39.14,35.05 v38.51,35.05
  Bottom 0.254: v38.51,35.05 35.21,35.05 34.06,36.2 34.06,36.32 U$1.24
BATT_VCC  (via drill 0.61)
  Top 0.66: VD1.2 9.3,22.35 C18.1 9.93,22.61 v10.82,21.72 | U3.2 8.54,14.61 8.16,14.99 8.16,17.02 9.3,18.16 9.3,19.05 C19.2 9.68,19.18 10.31,19.81 v10.82,19.81 | R24.1 27.08,23.75 14.51,36.32 14.51,44.96 16.03,46.48 U$7.P$2 U$7.VS U$7.P$1
  Bottom 0.66: v10.82,19.81 v10.82,21.72 10.95,21.97 10.95,43.81 U$7.P$2 | S3.2 15.39,52.07 U$7.P$1
BATT_VCC_RAW
  Bottom 0.66: J7.2 4.6,52.58 12.6,60.58 12.6,62.23 S3.1
BTN
  Top 0.254: U$3.32 44.48,29.97 44.48,30.86 42.83,32.51 35.29,32.51 U$1.22 | 34.06,33.78 U$1.22 | U$1.22 35.33,34.88 35.33,37.85 33.05,40.39 33.05,54.86 36.98,58.42 40.03,58.42 S1.3 40.08,56.33 R5.2
BUCK_EN
  Top 0.254: U$3.1 40.12,18.33 38.89,19.56 38.89,20.45 36.98,22.35 36.1,22.35 35.33,23.11 35.33,24.85 U$1.16
CAM1
  Top 0.254: R20.1 45.62,36.83 45.62,35.94 46.89,34.67 46.89,29.97 U$3.29
CAM2
  Top 0.254: R15.1 48.67,29.97 U$3.27
CAM3
  Top 0.254: R18.1 49.43,34.54 49.43,29.97 U$3.26
CAM4
  Top 0.254: R19.1 52.22,34.28 50.19,32.38 50.19,29.97 U$3.25
CAM_EN1
  Top 0.254: U$3.37 40.59,25.73 38.64,27.69 38.64,28.7 37.37,29.97 35.29,29.97 U$1.20
CAM_EN2
  Top 0.254: U$3.40 39.39,23.33 U$1.15
CAM_OUT1
  Top 0.66: 19.46,51.94 19.46,52.7 U$7.13 19.46,52.96 19.46,53.98 U$7.14 | 19.46,51.94 19.46,51.44 U$7.12 | 19.46,51.94 26.19,51.94 J9.2
CAM_OUT2
  Top 0.66: U$7.10 19.46,48.9 19.46,47.88 U$7.9 19.46,47.62 19.46,46.35 U$7.8 19.71,46.23 21.75,46.23 26.19,41.78 J10.2
CONV_5V  (via drill 0.61)
  Top 0.356: Q1.2 58.96,34.54 58.96,33.53 R10.2 60.1,32.26 60.1,30.73 v59.72,30.35
  Bottom 0.356: v59.72,30.35 59.72,14.61 60.23,14.1 60.23,7.75 59.46,6.99 35.33,6.99 34.06,8.26 U$1.2
DB_ANALOG_IO
  Bottom 0.254: U$8.24 65.81,36.2 65.81,35.43 67.08,34.16 67.08,25.65 67.97,24.77 68.86,24.77 78.39,15.24 78.39,12.7 78.89,12.19 RV1.P$2
DB_BTN
  Top 0.254: U$8.22 65.81,33.66 66.7,33.66 67.97,32.38 77.37,32.38 79.78,29.97 S6.2
DB_MISO
  Top 0.254: 79.72,18.86 79.78,18.92 79.78,20.95 S2.2 | 79.72,18.86 77.88,17.02 77.75,17.02 75.97,15.24 R21.2 | J6.1 87.28,13.46 81.94,18.8 79.78,18.8 79.72,18.86
DB_MOSI
  Top 0.254: S5.2 72.8,24.89 R14.1 77.24,27.94 81.18,24 81.18,22.1 86.26,17.02 88.93,17.02 91.98,13.97 91.98,12.95 90.58,11.56 J6.4
DB_SCK
  Top 0.254: R30.2 90.58,27.94 87.53,24.89 87.02,24.89 S4.2
  Bottom 0.254: J6.3 88.04,11.56 85.75,13.84 85.75,17.53 85.5,17.78 85.5,20.32 86.9,21.72 86.9,24.77 S4.2
DB_SCL
  Top 0.254: U$8.21 68.23,33.78 68.23,34.67 67.08,35.81 67.08,45.97 J1.3 J3.3
DB_SDA
  Top 0.254: U$8.23 68.35,36.32 68.35,44.45 J1.4 J3.4
GND  (via drill 0.6)
  Top 0.356: C2.1 48.03,10.29 43.33,10.29 C3.2 41.94,11.68 40.3,11.68 | ICSP1.6 58.32,8.38 56.92,6.99 51.34,6.99 49.69,8.64 C2.1 | 40.3,11.68 37.49,11.68 36.98,12.19 35.21,12.19 34.06,13.34 U$1.6 | D2.3 48.92,62.61 46.89,62.61 46.64,62.87 S1.2 46.51,62.74 42.83,59.31 42.83,55.88 41.68,54.74 39.27,54.74 36.6,52.07 J4.2 34.57,50.34 34.57,45.21 34.95,44.96 35.08,44.96 | C5.1 56.54,21.08 56.54,21.34 55.27,22.48 53.62,22.48 U$3.15 53.5,22.61 47.02,22.61 | Q2.3 52.99,31.11 51.84,29.97 U$3.23 51.72,29.84 51.72,28.96 50.07,27.3 47.02,27.3 | Q2.3 57.56,31.11 C4.1 | 45.47,27.33 43.84,28.96 43.84,29.84 U$3.33 | 47.02,27.3 45.49,27.3 45.47,27.33 | 47.02,22.61 47.02,22.35 | 47.02,22.35 47.02,18.41 U$3.5 | Q2.3 54.26,31.24 54.26,35.43 JP1.1 54.26,35.56 54.26,38.48 53.5,39.24 IC2.4 53.37,39.37 53.37,40.26 52.73,40.89 51.59,40.89 50.95,40.26 IC2.2 50.95,40.13 50.19,40.89 48.67,40.89 47.91,40.13 IC1.4 47.78,40.13 47.02,40.89 46,40.89 45.24,40.13 IC1.2 45.24,40.77 44.61,41.4 41.18,44.96 36.86,44.96 | X2.5 47.81,6.38 49.05,7.62 49.05,8.25 C2.1 | U$3.35 45.47,27.33 | 47.02,22.61 47.02,27.3 | U$3.43 41.15,20.93 40.29,20.07 v40.29,19.56 | 40.3,11.68 40.29,11.7 v40.29,13.59 | v46.26,22.61 46.51,22.35 47.02,22.35 | 35.08,44.96 36.86,44.96 | RTC2.5 36.98,44.83 36.86,44.96 | C1.2 35.08,44.96
  Bottom 0.356: v40.29,13.59 v40.29,19.56 43.33,22.61 v46.26,22.61 | 36.43,51.94 J4.2
GND-ISO
  Top 0.356: 14.51,19.05 14.51,19.68 R1.2 | 14.51,19.05 14.51,17.78 C15.1 14.51,17.65 14.51,14.35 14.76,14.1 U3.P$1 | C19.1 14.51,19.05 | U3.P$1 14.76,13.84 12.98,12.06 U3.4 12.09,11.94 8.54,11.94 8.28,12.19 4.35,12.19 3.2,13.34 2.31,13.34 U$2.6 | U3.P$1 14.12,13.08 17.3,9.91 19.71,9.91 C17.1 19.84,9.91 22.89,9.91 C16.1 23.02,9.78 23.78,9.02 25.81,9.02 26.19,9.4 26.19,12.83 25.43,13.59 R2.2 22.76,13.72 22.76,15.75 14.25,24.26 13.62,24.26 | 13.62,24.26 12.6,23.24 12.6,22.35 C18.2 | 13.62,24.26 13.62,26.54 9.68,30.48 VD2.1 9.68,36.7 R12.1 12.35,39.5 R16.1 12.47,42.04 12.47,44.07 14.25,45.85 14.25,54.74 | J10.1 26.19,49.91 27.59,51.31 27.59,53.34 26.19,54.74 J9.1 26.06,54.74 14.25,54.74 | R17.2 3.08,39.37 1.93,40.51 R11.2 1.93,42.04 1.93,51.18 4.98,54.23 J7.1 4.6,54.74 5.36,53.98 U$7.1 12.86,53.98 13.62,54.74 14.25,54.74
GND-ISO2
  pour Bottom: 0.03,0 30,0 30,64.77 0.03,64.77
LED  (via drill 0.6)
  Top 0.254: U$3.31 45.38,31.23 43.21,33.4 39.65,33.4 v39.4,33.53 | v43.97,52.07 47.65,52.07 R_LED.1
  Bottom 0.254: v39.4,33.53 39.4,47.37 v43.97,52.07
MISO
  Top 0.254: ICSP1.1 51.84,17.91 51.84,18.29 U$3.11
MOSI
  Top 0.254: ICSP1.4 60.23,12.32 60.23,13.97 59.34,14.86 57.3,14.86 52.61,19.56 51.46,19.56 51.08,19.18 51.08,18.41 U$3.10
N$1
  Top 0.254: J5.1 56.92,50.04 59.08,47.88 59.34,47.88 60.23,46.99 60.23,45.34 J2.4
N$4
  Top 0.254: U$3.3 45.37,18.29 45.37,12.45 44.61,11.68 RUSB1.1
N$5
  Top 0.254: U$3.4 46.26,18.29 46.26,12.57 47.14,11.68 RUSB2.1
N$6
  Bottom 0.254: J2.6 58.83,42.04 60.23,43.43 60.23,48.64 J5.2
N$7
  Top 0.254: D2.4 48.92,59.31 48.92,56.01 47.78,54.86 R_LED.2
N$8
  Top 0.254: C4.2 58.19,28.57 58.19,26.54 57.69,26.04 Y1.3 57.56,25.91 55.78,24.13 U$3.17
N$9
  Top 0.254: C5.2 60.1,22.23 Y1.1 59.97,22.35 58.7,23.62 56.92,23.62 56.67,23.37 53.62,23.37 U$3.16
N$10
  Top 0.254: X2.2 45.88,4.83 45.88,7.37 44.61,8.64 RUSB1.2
N$11
  Top 0.254: X2.3 46.51,8 47.14,8.64 RUSB2.2
N$12
  Top 0.254: R18.2 50.32,37.97 49.69,38.61 IC2.1
N$13
  Top 0.254: IC2.3 R19.2
N$15
  Top 0.254: R15.2 46.76,36.83 46.76,38.99 46.51,39.24 IC1.3
N$16
  Top 0.254: R13.2 55.53,48.9 56.54,47.88 57.43,47.88 J2.2
N$18
  Top 0.254: IC1.8 43.97,45.21 45.62,46.86 45.62,48.9 R13.1
N$19
  Top 0.254: R20.2 43.72,38.99 43.97,39.24 IC1.1
N$20
  Top 0.254: U$3.6 47.78,13.46 49.56,11.68 C2.2
N$22  (via drill 0.6)
  Top 0.254: C3.1 42.06,8.89 40.8,10.16 39.91,10.16 v39.65,10.41 | v48.8,14.22 48.58,14.44 U$3.7
  Top 0.356: 41.71,8.41 C3.1 | F2.2 v39.65,10.41
  Bottom 0.254: v39.65,10.41 44.99,10.41 v48.8,14.22
N$25
  Top 0.254: C15.2 16.41,17.78 16.41,16.76 17.3,15.88 U3.8
N$26  (via drill 0.61)
  Top 0.356: U3.3 12.09,13.34 11.97,13.21 C13.2 9.55,13.21 v7.9,13.21 | v7.9,11.18 9.55,9.53 L2.2
  Bottom 0.356: v7.9,11.18 v7.9,13.21
N$27
  Top 0.254: C13.1 11.97,16 12.09,15.88 U3.1
N$28
  Top 0.254: C14.1 19.84,16.26 16.41,19.68 R1.1
N$29
  Top 0.254: C14.2 19.84,13.59 17.68,13.59 17.43,13.34 U3.6
N$30
  Top 0.254: R3.1 25.17,10.16 23.65,11.68 22.89,11.68 R2.1 22.63,12.06 U3.5
N$31
  Top 0.254: IC1.6 46.51,45.21 48.42,47.12 55.65,47.12 J2.1
  Bottom 0.254: J2.1 54.64,48.13 54.64,52.7 X1.3
N$32
  Top 0.254: IC2.8 49.69,45.21 51.08,46.61 53.62,46.61 J2.3
  Bottom 0.254: J2.3 51.59,48.64 51.59,54.61 X1.2
N$33
  Top 0.254: IC2.6 52.22,43.81 54.64,41.4 J2.5
N$34
  Top 0.254: JP1.2 55.27,35.56 55.27,37.85 J2.7 56.03,38.73 50.95,43.81 | 50.95,43.81 IC2.7 | 50.95,43.81 50.07,42.93 48.54,42.93 47.78,43.69 IC1.5 47.78,43.81 46.89,42.93 46.13,42.93 45.24,43.81 IC1.7 45.24,45.21 47.02,46.99 47.02,49.66 47.65,50.29 48.42,50.29 49.18,51.05 49.18,54.86 50.95,56.64 52.1,56.64 52.22,56.52 X1.1 | IC2.5 53.5,45.21 52.61,46.1 51.84,46.1 50.95,45.21 IC2.7 | 50.95,44.45 IC2.7
N$35
  Top 0.254: Q1.3 57.94,37.97 J2.8
N$36
  Top 0.254: 57.05,32.13 57.94,32.13 58.19,32.38 R10.1 | 57.05,32.13 56.42,32.13 Q2.2 | 57.05,32.13 57.05,34.54 Q1.1
N$38
  Top 0.356: X2.1 45.21,6.38 44.61,6.99 41.2,6.99 40.95,6.75 F2.1
N$39
  Top 0.356: J4.1 36.3,54.56 33.71,52.05 33.68,43.1 C1.1 35.08,40.13 35.84,39.37 37.11,39.37 38.13,40.39 38.13,41.71 RTC2.6
N$43
  Top 0.254: R22.2 78.01,8.76 81.31,12.06 RV1.P$1
PB_BUCK_EN
  Top 0.254: R24.2 24.29,12.06 23.65,12.7 22.13,12.7 20.86,13.97 20.86,14.35 20.79,14.41 | 20.79,14.41 20.6,14.61 U3.7 | U$2.16 2.31,26.04 2.31,25.27 3.58,24 3.58,23.11 4.47,22.23 7.27,22.23 8.79,20.7 16.92,20.7 20.86,16.76 20.86,14.48 20.79,14.41
PB_CAM_EN1
  Top 0.254: U$2.20 2.31,31.24 4.73,33.66 R11.1 4.85,41.91 4.85,45.47 12.09,52.7 U$7.2
PB_CAM_EN2
  Top 0.254: U$7.6 12.09,47.62 11.08,46.61 11.08,41.15 9.55,39.62 R12.2 9.43,39.37 8.28,38.23 8.28,30.35 4.85,26.92 4.85,26.16 U$2.15
PB_CONV_5V
  Top 0.356: R3.2 27.08,9.4 24.41,6.73 23.02,6.73 C16.2 22.89,6.73 19.84,6.73 C17.2 19.71,6.6 16.16,3.05 L2.1 12.35,6.73 4.22,6.73 2.69,8.26 2.31,8.26 U$2.2
PB_PROFET_1
  Top 0.254: U$2.18 2.31,28.7 3.46,29.84 3.46,31.5 6,34.04 R17.1 6.12,39.37 6.12,45.47 12.09,51.44 U$7.3
PB_PROFET_2
  Top 0.254: U$7.4 12.09,50.16 7.27,45.34 7.27,33.66 4.85,31.24 U$2.19
PB_PROFET_3
  Top 0.254: U$7.5 12.09,48.9 9.55,46.35 R16.2 9.43,41.91 7.78,40.26 7.78,32.38 4.85,29.46 4.85,28.7 U$2.17
PB_VD_DIRECT
  Top 0.254: VD2.2 9.68,27.69 9.55,27.56 VD1.1 6.63,25.4 4.85,23.62 U$2.13
PROFET1
  Top 0.254: U$3.39 40.29,24.13 36.98,27.43 35.29,27.43 U$1.18
PROFET2
  Top 0.254: U$3.36 40.55,26.53 39.4,27.69 39.4,30.23 38.64,30.99 36.81,30.99 U$1.19
PROFET3
  Top 0.254: U$3.38 40.33,24.93 U$1.17
RST  (via drill 0.61)
  Top 0.254: v49.69,20.32 52.22,20.32 52.73,20.83 53.5,20.83 U$3.13 | ICSP1.5 53.5,8.38 52.86,8.64 RRST.1
  Bottom 0.254: v49.69,20.32 49.69,14.99 ICSP1.5
RX  (via drill 0.6)
  Top 0.254: U$3.20 53.5,26.54 51.46,26.54 49.81,24.89 v48.42,24.89
  Bottom 0.254: U$1.8 34.06,16 35.33,17.27 38.38,17.27 38.89,17.78 38.89,19.56 44.1,24.89 v48.42,24.89
SCK
  Top 0.254: ICSP1.3 54.89,12.32 54.89,13.97 53.5,15.37 52.35,15.37 50.19,17.53 50.19,18.29 U$3.9
SCL  (via drill 0.6)
  Top 0.254: U$3.18 55.06,24.93 56.29,26.16 v56.29,28.07 | v41.56,40.01 40.54,40.01 | U$1.21 37.62,34.89 37.62,35.43 39.65,37.59 40.54,38.48 40.54,40.01 | 40.54,40.01 40.54,40.51 40.92,40.89 40.92,41.71 RTC2.8
  Bottom 0.254: v56.29,28.07 56.29,35.43 48.8,42.55 45.62,42.55 44.47,41.15 R8.1 v41.56,40.01
SDA  (via drill 0.6, 0.61)
  Top 0.254: v55.15,26.54 54.38,25.78 53.62,25.78 U$3.19 | U$1.23 39.53,39.2 RTC2.7 39.65,41.96 39.65,43.43 40.16,43.94 40.92,43.94 42.57,42.29 42.57,38.23 v42.45,38.1
  Bottom 0.254: v55.15,26.54 55.15,35.18 48.42,41.66 46.51,41.66 45.88,41.02 45.88,38.23 45.75,38.1 R9.2 45.11,38.1 v42.45,38.1
SWITCH_USB_VCC
  Top 0.254: Q2.1 56.29,30.1 55.53,30.1 53.62,28.19 U$3.22
TX  (via drill 0.61)
  Top 0.254: v48.03,26.29 49.94,26.29 50.95,27.3 53.5,27.3 U$3.21
  Bottom 0.254: v48.03,26.29 43.59,26.29 41.3,24 41.3,23.62 37.37,19.68 35.21,19.68 34.06,18.54 U$1.10
VCC  (via drill 0.6, 0.61)
  Top 0.356: D2.1 54.13,59.44 51.34,59.44 50.07,60.71 46.51,60.71 44.61,58.67 44.61,54.61 43.21,53.21 42.95,53.21 R5.1 40.16,51.18 | 40.16,51.18 39.53,50.55 RTC2.2 | 53.5,21.72 U$3.14 54.62,21.73 55.4,20.95 55.4,20.32 v56.67,19.05 | 50.95,29.08 50.95,29.84 U$3.24 50.98,31.52 v52.86,33.15 | RRST.2 52.22,13.59 v53.11,14.48 | 43.72,20.07 42.06,20.07 U$3.44 | 43.72,20.07 44.48,19.3 44.48,18.41 U$3.2 44.61,18.16 44.61,17.53 43.59,15.88 41.05,15.88 37.11,19.81 36.1,19.81 35.33,20.57 35.33,22.23 34.06,23.5 U$1.14 | 43.72,20.07 43.72,21.21 42.83,21.72 42.06,21.72 U$3.42 | U$3.34 41.94,28.07 41.3,28.07 v40.41,28.83 | 40.16,51.18 v42.45,48.51
  Bottom 0.356: ICSP1.2 58.83,16 57.81,17.08 56.67,17.08 | 56.67,17.08 55.84,17.08 v53.11,14.48 | 49.69,30.48 49.69,23.75 52.35,21.08 54.64,21.08 v56.67,19.05 56.67,17.08 | U$1.14 34.06,23.62 35.33,24.89 37.87,24.89 39.14,26.16 39.14,27.43 v40.41,28.83 40.41,35.31 | 40.41,35.31 40.41,46.35 v42.45,48.51 | 46.83,33.34 44.86,35.31 40.41,35.31 | 46.83,33.34 49.69,30.48 | v52.86,33.15 49.69,30.48 | 46.83,33.34 48.55,35.05 R9.1 48.55,38.73 R8.2
VCC_2
  Top 0.356: R22.1 71.91,14.22 72.93,15.24 R21.1 72.93,15.37 72.93,16.13 69.62,19.43 69.62,24 68.86,24.77 68.86,24.89 | 68.86,24.89 71.91,27.94 R14.2 73.18,27.94 74.58,29.34 76.86,29.34 78.26,27.94 R30.1 | 68.86,24.89 67.08,24.89 65.81,23.62 U$8.14
VD_DIRECT
  Top 0.254: U$3.41 37.65,22.53 U$1.13

### Text on the board
tPlace: ON | OFF | - | - | + | 1 | + | - | COIN CELL | + | - | RTC | 2 | + | compressed | time.de | 3.3V | GND | 5V
bPlace: ON | OFF | CONTROLLER7 | POWERBOARD1 | + | 7 | TIME | BOX | CONTROLLER7 | BOARD1